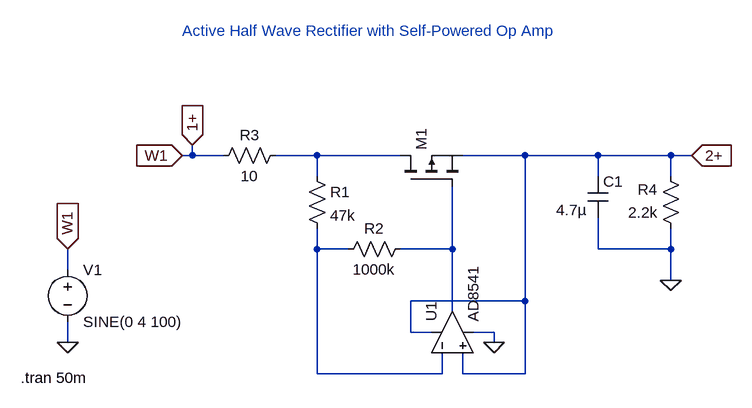
[diagram p0: schematic active_ref_sel_pow_op_amp_ltspice.asc]
active_ref_sel_pow_op_amp_ltspice.asc, the LTspice schematic file:
Version 4
SHEET 1 880 680
WIRE -192 -112 -192 -128
WIRE -192 -112 -208 -112
WIRE -144 -112 -192 -112
WIRE 0 -112 -64 -112
WIRE 128 -112 0 -112
WIRE 320 -112 224 -112
WIRE 432 -112 320 -112
WIRE 544 -112 432 -112
WIRE 576 -112 544 -112
WIRE 0 -80 0 -112
WIRE 432 -80 432 -112
WIRE 544 -80 544 -112
WIRE 0 32 0 0
WIRE 48 32 0 32
WIRE 208 32 208 -64
WIRE 208 32 128 32
WIRE 432 32 432 -16
WIRE 544 32 544 0
WIRE 544 32 432 32
WIRE -384 64 -384 32
WIRE 544 80 544 32
WIRE 320 112 320 -112
WIRE 320 112 144 112
WIRE 208 128 208 32
WIRE 144 160 144 112
WIRE 176 160 144 160
WIRE 272 160 240 160
WIRE -384 176 -384 144
WIRE 272 176 272 160
WIRE 0 224 0 32
WIRE 192 224 192 192
WIRE 192 224 0 224
WIRE 224 224 224 192
WIRE 320 224 320 112
WIRE 320 224 224 224
FLAG 544 80 0
FLAG -208 -112 W1
IOPIN -208 -112 In
FLAG -192 -128 1+
IOPIN -192 -128 In
FLAG 576 -112 2+
IOPIN 576 -112 In
FLAG -384 176 0
FLAG -384 32 W1
IOPIN -384 32 In
FLAG 272 176 0
SYMBOL Opamps\\AD8541 144 160 R270
SYMATTR InstName U1
SYMBOL pmos 128 -64 R270
WINDOW 3 56 72 Invisible 2
SYMATTR InstName M1
SYMATTR Value BSS84
SYMBOL cap 416 -80 R0
WINDOW 3 -48 52 Left 2
SYMATTR InstName C1
SYMATTR Value 4.7µ
SYMBOL res -16 -96 R0
SYMATTR InstName R1
SYMATTR Value 47k
SYMBOL res 144 16 R90
WINDOW 0 0 56 VBottom 2
WINDOW 3 32 56 VTop 2
SYMATTR InstName R2
SYMATTR Value 1000k
SYMBOL res -48 -128 R90
WINDOW 0 0 56 VBottom 2
WINDOW 3 32 56 VTop 2
SYMATTR InstName R3
SYMATTR Value 10
SYMBOL res 560 16 R180
WINDOW 0 36 76 Left 2
WINDOW 3 36 40 Left 2
SYMATTR InstName R4
SYMATTR Value 2.2k
SYMBOL voltage -384 48 R0
WINDOW 123 0 0 Left 0
WINDOW 39 0 0 Left 0
SYMATTR InstName V1
SYMATTR Value SINE(0 4 100)
TEXT -456 230 Left 2 !.tran 50m
TEXT -208 -304 Left 2 ;Active Half Wave Rectifier with Self-Powered Op Amp

The netlist it stands for:
* active_ref_sel_pow_op_amp_ltspice.asc
XU1 2+ N002 2+ 0 N003 AD8541  ; pins In+ In- V+ V- OUT
M1 N001 N003 2+ 2+ BSS84
C1 2+ 0 4.7µ
R1 N001 N002 47k
R2 N003 N002 1000k
R3 N001 1+ 10
R4 0 2+ 2.2k
V1 1+ 0 SINE(0 4 100)
.model NMOS NMOS
.model PMOS PMOS
.lib standard.mos
.tran 50m
* Active Half Wave Rectifier with Self-Powered Op Amp
.backanno
.end